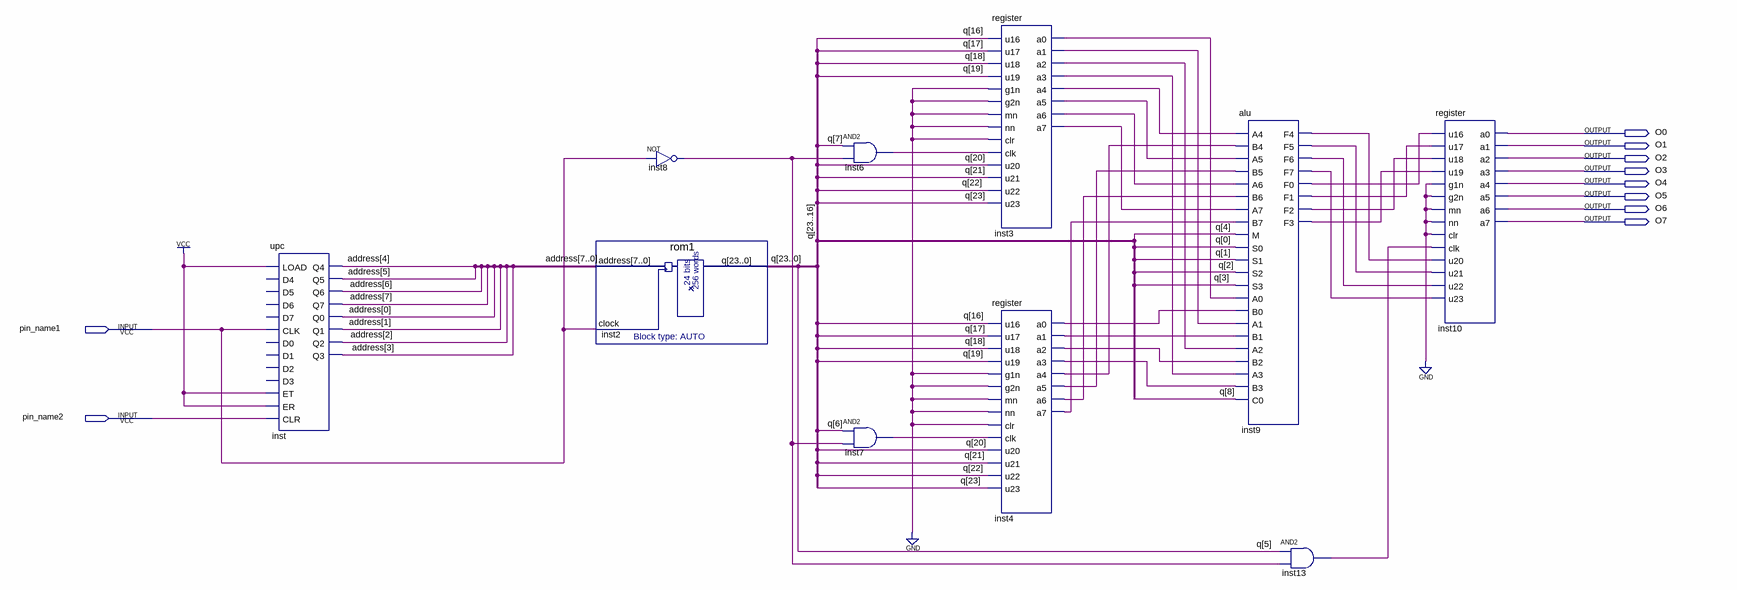
[diagram p0: schematic sheet]
// Quartus schematic lab1.bdf as structural Verilog: 10 symbols, 10 pins
module lab1 (
  input  pin_name1,
  input  pin_name2,
  output O0,
  output O1,
  output O2,
  output O3,
  output O4,
  output O5,
  output O6,
  output O7
);

  wire inst3_a0, inst3_a1, inst3_a2, inst3_a3, inst3_a4, inst3_a5, inst3_a6, inst3_a7, inst4_a0, inst4_a1,
       inst4_a2, inst4_a3, inst4_a4, inst4_a5, inst4_a6, inst4_a7, inst6_out, inst7_out, inst8_out, inst9_f0,
       inst9_f1, inst9_f2, inst9_f3, inst9_f4, inst9_f5, inst9_f6, inst9_f7, inst13_out;
  wire [7:0] address;
  wire [23:0] q;

  upc inst (
    .LOAD(1'b1), .CLK(pin_name1), .ET(1'b1), .ER(1'b1), .CLR(pin_name2), .Q4(address[4]), .Q5(address[5]),
    .Q6(address[6]), .Q7(address[7]), .Q0(address[0]), .Q1(address[1]), .Q2(address[2]), .Q3(address[3]));  // open: D4, D5, D6, D7, D0, D1, D2, D3
  rom1 inst2 (.address(address), .clock(pin_name1), .q(q));
  not inst8 (inst8_out, pin_name1);
  and inst6 (inst6_out, q[7], inst8_out);
  and inst7 (inst7_out, q[6], inst8_out);
  register inst3 (
    .u16(q[16]), .u17(q[17]), .u18(q[18]), .u19(q[19]), .g1n(1'b0), .g2n(1'b0), .mn(1'b0), .nn(1'b0),
    .clr(1'b0), .clk(inst6_out), .u20(q[20]), .u21(q[21]), .u22(q[22]), .u23(q[23]), .a0(inst3_a0),
    .a1(inst3_a1), .a2(inst3_a2), .a3(inst3_a3), .a4(inst3_a4), .a5(inst3_a5), .a6(inst3_a6), .a7(inst3_a7));
  register inst4 (
    .u16(q[16]), .u17(q[17]), .u18(q[18]), .u19(q[19]), .g1n(1'b0), .g2n(1'b0), .mn(1'b0), .nn(1'b0),
    .clr(1'b0), .clk(inst7_out), .u20(q[20]), .u21(q[21]), .u22(q[22]), .u23(q[23]), .a0(inst4_a0),
    .a1(inst4_a1), .a2(inst4_a2), .a3(inst4_a3), .a4(inst4_a4), .a5(inst4_a5), .a6(inst4_a6), .a7(inst4_a7));
  alu inst9 (
    .A4(inst3_a4), .B4(inst4_a4), .A5(inst3_a5), .B5(inst4_a5), .A6(inst3_a6), .B6(inst4_a6), .A7(inst3_a7),
    .B7(inst4_a7), .M(q[4]), .S0(q[0]), .S1(q[1]), .S2(q[2]), .S3(q[3]), .A0(inst3_a0), .B0(inst4_a0),
    .A1(inst3_a1), .B1(inst4_a1), .A2(inst3_a2), .B2(inst4_a2), .A3(inst3_a3), .B3(inst4_a3), .C0(q[8]),
    .F4(inst9_f4), .F5(inst9_f5), .F6(inst9_f6), .F7(inst9_f7), .F0(inst9_f0), .F1(inst9_f1), .F2(inst9_f2),
    .F3(inst9_f3));
  and inst13 (inst13_out, q[5], inst8_out);
  register inst10 (
    .u16(inst9_f0), .u17(inst9_f1), .u18(inst9_f2), .u19(inst9_f3), .g1n(1'b0), .g2n(1'b0), .mn(1'b0),
    .nn(1'b0), .clr(1'b0), .clk(inst13_out), .u20(inst9_f4), .u21(inst9_f5), .u22(inst9_f6), .u23(inst9_f7),
    .a0(O0), .a1(O1), .a2(O2), .a3(O3), .a4(O4), .a5(O5), .a6(O6), .a7(O7));
endmodule
